# Altium schematic sheet 7_SEGMENT.SchDoc
size A; DocumentNumber: 6; SheetNumber: 6; SheetTotal: 12
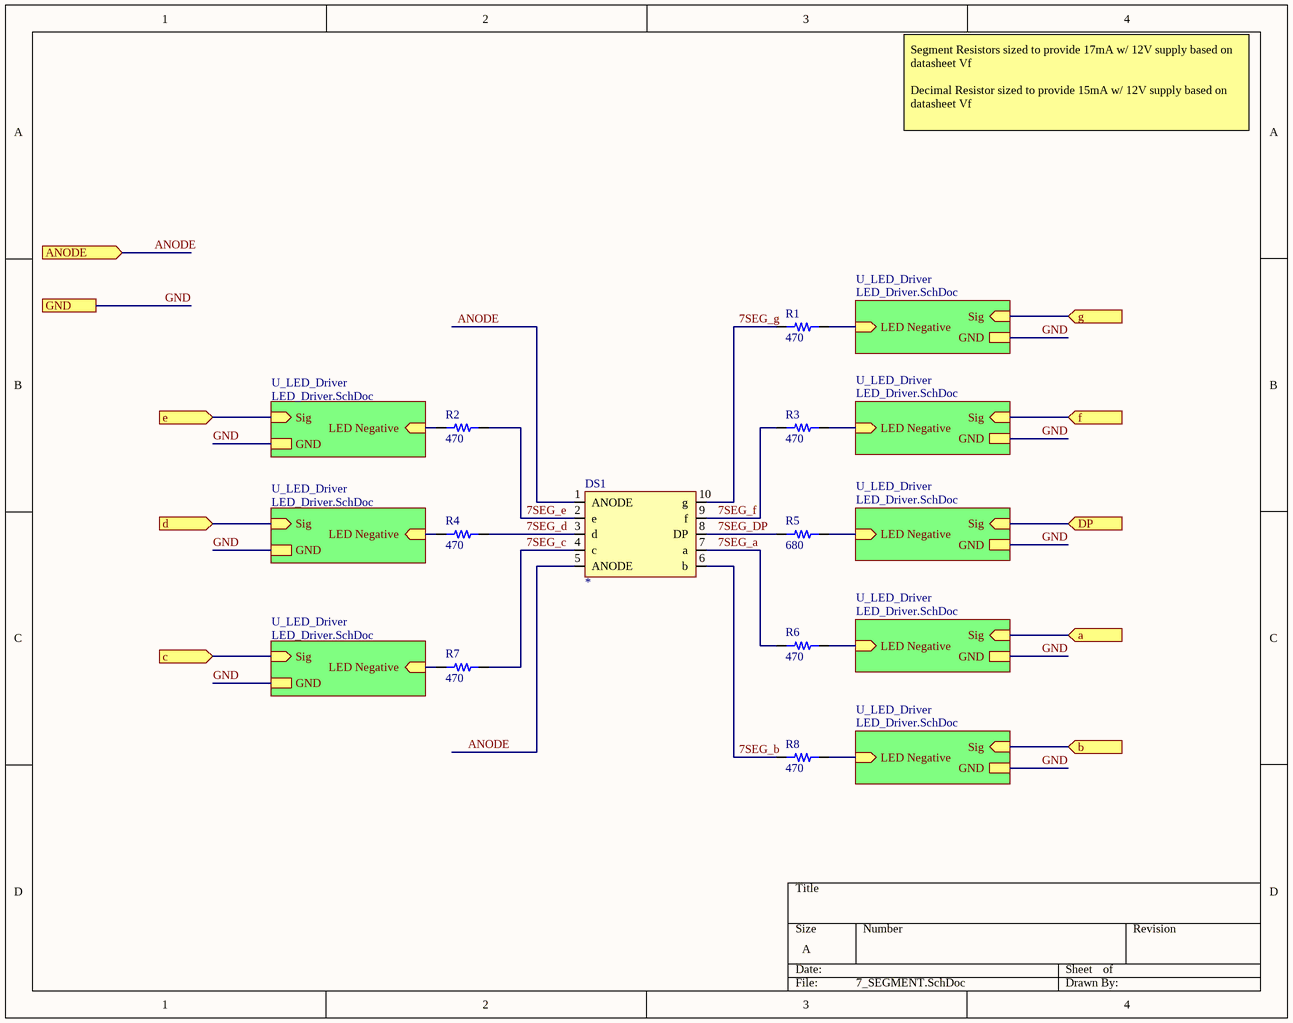
[diagram p0: 7_SEGMENT.SchDoc]

## Parts
DS1  *  [SA15-11EWA]
R1  470  [RES 0805/2012]
R2  470  [RES 0805/2012]
R3  470  [RES 0805/2012]
R4  470  [RES 0805/2012]
R5  680  [RES 0805/2012]
R6  470  [RES 0805/2012]
R7  470  [RES 0805/2012]
R8  470  [RES 0805/2012]

## Sub-sheets
U_LED_Driver = LED_Driver.SchDoc: LED Negative (in), Sig (in), GND
U_LED_Driver = LED_Driver.SchDoc: LED Negative (in), Sig (in), GND
U_LED_Driver = LED_Driver.SchDoc: LED Negative (in), Sig (in), GND
U_LED_Driver = LED_Driver.SchDoc: LED Negative (in), Sig (in), GND
U_LED_Driver = LED_Driver.SchDoc: LED Negative (in), Sig (in), GND
U_LED_Driver = LED_Driver.SchDoc: LED Negative (in), Sig (in), GND
U_LED_Driver = LED_Driver.SchDoc: LED Negative (in), Sig (in), GND
U_LED_Driver = LED_Driver.SchDoc: LED Negative (in), Sig (in), GND

## Ports
a (in), ANODE (in), b (in), c (in), d (in), DP (in), e (in), f (in), g (in), GND

## Nets
7SEG_a: DS1.7(a) R6.1
7SEG_b: DS1.6(b) R8.1
7SEG_c: DS1.4(c) R7.2
7SEG_d: DS1.3(d) R4.2
7SEG_DP: DS1.8(DP) R5.1
7SEG_e: DS1.2(e) R2.2
7SEG_f: DS1.9(f) R3.1
7SEG_g: DS1.10(g) R1.1
a: port a, sheet U_LED_Driver/Sig
ANODE: DS1.1(ANODE) DS1.5(ANODE) ; port ANODE
b: port b, sheet U_LED_Driver/Sig
c: port c, sheet U_LED_Driver/Sig
d: port d, sheet U_LED_Driver/Sig
DP: port DP, sheet U_LED_Driver/Sig
e: port e, sheet U_LED_Driver/Sig
f: port f, sheet U_LED_Driver/Sig
g: port g, sheet U_LED_Driver/Sig
GND: port GND, sheet U_LED_Driver/GND, sheet U_LED_Driver/GND, sheet U_LED_Driver/GND, sheet U_LED_Driver/GND, sheet U_LED_Driver/GND, sheet U_LED_Driver/GND, sheet U_LED_Driver/GND, sheet U_LED_Driver/GND
NetR1_2: R1.2 ; sheet U_LED_Driver/LED Negative
NetR2_1: R2.1 ; sheet U_LED_Driver/LED Negative
NetR3_2: R3.2 ; sheet U_LED_Driver/LED Negative
NetR4_1: R4.1 ; sheet U_LED_Driver/LED Negative
NetR5_2: R5.2 ; sheet U_LED_Driver/LED Negative
NetR6_2: R6.2 ; sheet U_LED_Driver/LED Negative
NetR7_1: R7.1 ; sheet U_LED_Driver/LED Negative
NetR8_2: R8.2 ; sheet U_LED_Driver/LED Negative

## Notes on the sheet
- Segment Resistors sized to provide 17mA w/ 12V supply based on datasheet Vf
  Decimal Resistor sized to provide 15mA w/ 12V supply based on datasheet Vf

## Library data of the parts
DS1 = 40: 7SEG DISPLAY 1DIGIT RED 1.5" CA; id: 40; vcc: 4; voltageinmax: 5; MfrPartNo: *; name: SA15-11EWA; quantity: 0; link: https://www.digikey.com/short/pdvmpz; createdby: Kevin
R1-R8 = 2: id: 2; name: 0805 Resistor; percent tolerance: 5; power: 1/4; package: 0805; quantity: 0; createdby: Kevin
  R1-R4 R6-R8: resistance: 470
  R5: resistance: 680